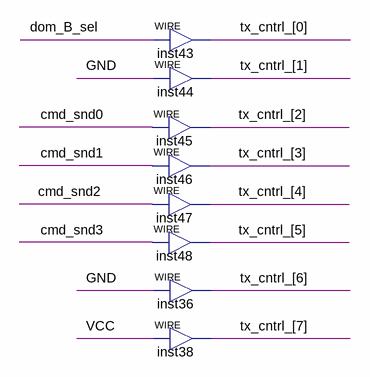
[diagram p0: schematic sheet]
// Quartus schematic temp_bdf.bdf as structural Verilog: 8 symbols, 0 pins
module temp_bdf (
);

  wire cmd_snd0, cmd_snd1, cmd_snd2, cmd_snd3, dom_B_sel, GND, VCC;
  wire [7:0] tx_cntrl_;

  assign tx_cntrl_[0] = dom_B_sel;  // WIRE inst43
  assign tx_cntrl_[1] = GND;  // WIRE inst44
  assign tx_cntrl_[2] = cmd_snd0;  // WIRE inst45
  assign tx_cntrl_[3] = cmd_snd1;  // WIRE inst46
  assign tx_cntrl_[4] = cmd_snd2;  // WIRE inst47
  assign tx_cntrl_[5] = cmd_snd3;  // WIRE inst48
  assign tx_cntrl_[6] = GND;  // WIRE inst36
  assign tx_cntrl_[7] = VCC;  // WIRE inst38
endmodule
